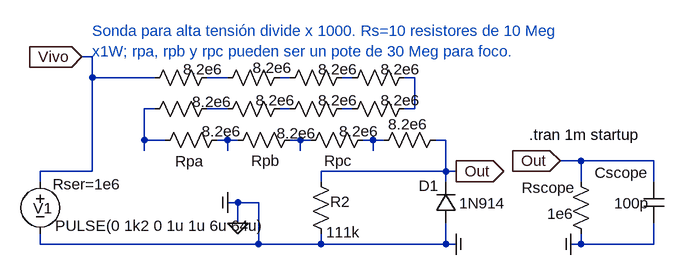
[diagram p0: schematic SondaHvDiv1k.asc]
SondaHvDiv1k.asc, the LTspice schematic file:
Version 4
SHEET 1 880 680
WIRE -368 96 -384 96
WIRE -368 128 -368 96
WIRE -272 128 -368 128
WIRE -160 128 -192 128
WIRE -64 128 -80 128
WIRE 32 128 16 128
WIRE 128 128 112 128
WIRE -272 176 -288 176
WIRE -160 176 -192 176
WIRE -64 176 -80 176
WIRE 32 176 16 176
WIRE 128 176 128 128
WIRE 128 176 112 176
WIRE -288 224 -288 176
WIRE -256 224 -288 224
WIRE -160 224 -176 224
WIRE -144 224 -160 224
WIRE -48 224 -64 224
WIRE -32 224 -48 224
WIRE 64 224 48 224
WIRE 80 224 64 224
WIRE 176 224 160 224
WIRE -288 240 -288 224
WIRE -160 240 -160 224
WIRE -48 240 -48 224
WIRE 64 240 64 224
WIRE 384 256 352 256
WIRE 496 256 384 256
WIRE -368 272 -368 128
WIRE -368 272 -448 272
WIRE 176 272 176 224
WIRE 176 272 -16 272
WIRE 192 272 176 272
WIRE -448 288 -448 272
WIRE -16 288 -16 272
WIRE 176 288 176 272
WIRE 384 288 384 256
WIRE 496 288 496 256
WIRE -144 320 -160 320
WIRE -112 320 -144 320
WIRE -144 352 -144 320
WIRE -448 384 -448 368
WIRE -112 384 -112 320
WIRE -112 384 -448 384
WIRE -16 384 -16 368
WIRE -16 384 -112 384
WIRE 176 384 176 352
WIRE 176 384 -16 384
WIRE 192 384 176 384
WIRE 384 384 384 368
WIRE 384 384 368 384
WIRE 496 384 496 352
WIRE 496 384 384 384
FLAG -384 96 Vivo
IOPIN -384 96 In
FLAG -160 320 Com
IOPIN -160 320 In
FLAG 192 272 Out
IOPIN 192 272 Out
FLAG 192 384 Com
IOPIN 192 384 Out
FLAG 352 256 Out
IOPIN 352 256 In
FLAG 368 384 Com
IOPIN 368 384 In
FLAG -144 352 0
SYMBOL res -32 272 R0
WINDOW 0 30 47 Left 0
WINDOW 3 24 94 Left 0
SYMATTR InstName R2
SYMATTR Value 111k
SYMBOL res 368 272 R0
WINDOW 0 -75 25 Left 0
WINDOW 3 -36 65 Left 0
SYMATTR InstName Rscope
SYMATTR Value 1e6
SYMBOL cap 480 288 R0
WINDOW 0 -75 -14 Left 0
WINDOW 3 -45 33 Left 0
SYMATTR InstName Cscope
SYMATTR Value 100p
SYMBOL diode 192 352 R180
WINDOW 0 27 58 Left 0
WINDOW 3 -76 31 Left 0
SYMATTR InstName D1
SYMATTR Value 1N914
SYMBOL voltage -448 272 R0
WINDOW 0 -11 57 Left 0
WINDOW 3 23 84 Left 0
WINDOW 123 0 0 Left 0
WINDOW 39 19 20 Left 0
SYMATTR InstName V1
SYMATTR Value PULSE(0 1k2 0 1u 1u 6u 64u)
SYMATTR SpiceLine Rser=1e6
SYMBOL res 176 208 R90
WINDOW 0 -4 88 Invisible 0
WINDOW 3 -24 58 VTop 0
SYMATTR InstName R3
SYMATTR Value 8.2e6
SYMBOL res -64 112 R90
WINDOW 0 14 103 Invisible 0
WINDOW 3 -15 27 VTop 0
SYMATTR InstName R5
SYMATTR Value 8.2e6
SYMBOL res 32 112 R90
WINDOW 0 14 101 Invisible 0
WINDOW 3 -13 22 VTop 0
SYMATTR InstName R6
SYMATTR Value 8.2e6
SYMBOL res 32 160 R90
WINDOW 0 14 101 Invisible 0
WINDOW 3 -13 22 VTop 0
SYMATTR InstName R7
SYMATTR Value 8.2e6
SYMBOL res -64 160 R90
WINDOW 0 14 101 Invisible 0
WINDOW 3 -13 22 VTop 0
SYMATTR InstName R8
SYMATTR Value 8.2e6
SYMBOL res 128 112 R90
WINDOW 0 14 101 Invisible 0
WINDOW 3 -13 22 VTop 0
SYMATTR InstName R9
SYMATTR Value 8.2e6
SYMBOL res 128 160 R90
WINDOW 0 14 101 Invisible 0
WINDOW 3 -13 22 VTop 0
SYMATTR InstName R10
SYMATTR Value 8.2e6
SYMBOL res -48 208 R90
WINDOW 0 32 53 VTop 0
WINDOW 3 -10 6 VTop 0
SYMATTR InstName Rpb
SYMATTR Value 8.2e6
SYMBOL res -160 208 R90
WINDOW 0 33 58 VTop 0
WINDOW 3 -13 9 VTop 0
SYMATTR InstName Rpa
SYMATTR Value 8.2e6
SYMBOL res 64 208 R90
WINDOW 0 32 54 VTop 0
WINDOW 3 -13 22 VTop 0
SYMATTR InstName Rpc
SYMATTR Value 8.2e6
SYMBOL res -176 160 R90
WINDOW 0 14 101 Invisible 0
WINDOW 3 -11 8 VTop 0
SYMATTR InstName R1
SYMATTR Value 8.2e6
SYMBOL res -176 112 R90
WINDOW 0 14 101 Invisible 0
WINDOW 3 -13 22 VTop 0
SYMATTR InstName R4
SYMATTR Value 8.2e6
TEXT -368 56 Left 0 ;Sonda para alta tensión divide x 1000. Rs=10 resistores de 10 Meg\nx1W; rpa, rpb y rpc pueden ser un pote de 30 Meg para foco.
TEXT 304 216 Left 0 !.tran 1m startup

The netlist it stands for:
* SondaHvDiv1k.asc
R2 Out 0 111k
Rscope Out 0 1e6
Cscope Out 0 100p
D1 0 Out 1N914
V1 Vivo 0 PULSE(0 1k2 0 1u 1u 6u 64u) Rser=1e6
R3 Out N011 8.2e6
R5 N002 N001 8.2e6
R6 N003 N002 8.2e6
R7 N008 N007 8.2e6
R8 N007 N006 8.2e6
R9 N004 N003 8.2e6
R10 N004 N008 8.2e6
Rpb N010 N009 8.2e6
Rpa N009 N005 8.2e6
Rpc N011 N010 8.2e6
R1 N006 N005 8.2e6
R4 N001 Vivo 8.2e6
.model D D
.lib standard.dio
* Sonda para alta tensión divide x 1000. Rs=10 resistores de 10 Meg
* x1W; rpa, rpb y rpc pueden ser un pote de 30 Meg para foco.
.tran 1m startup
.backanno
.end